# Altium project sensor.PrjPCB
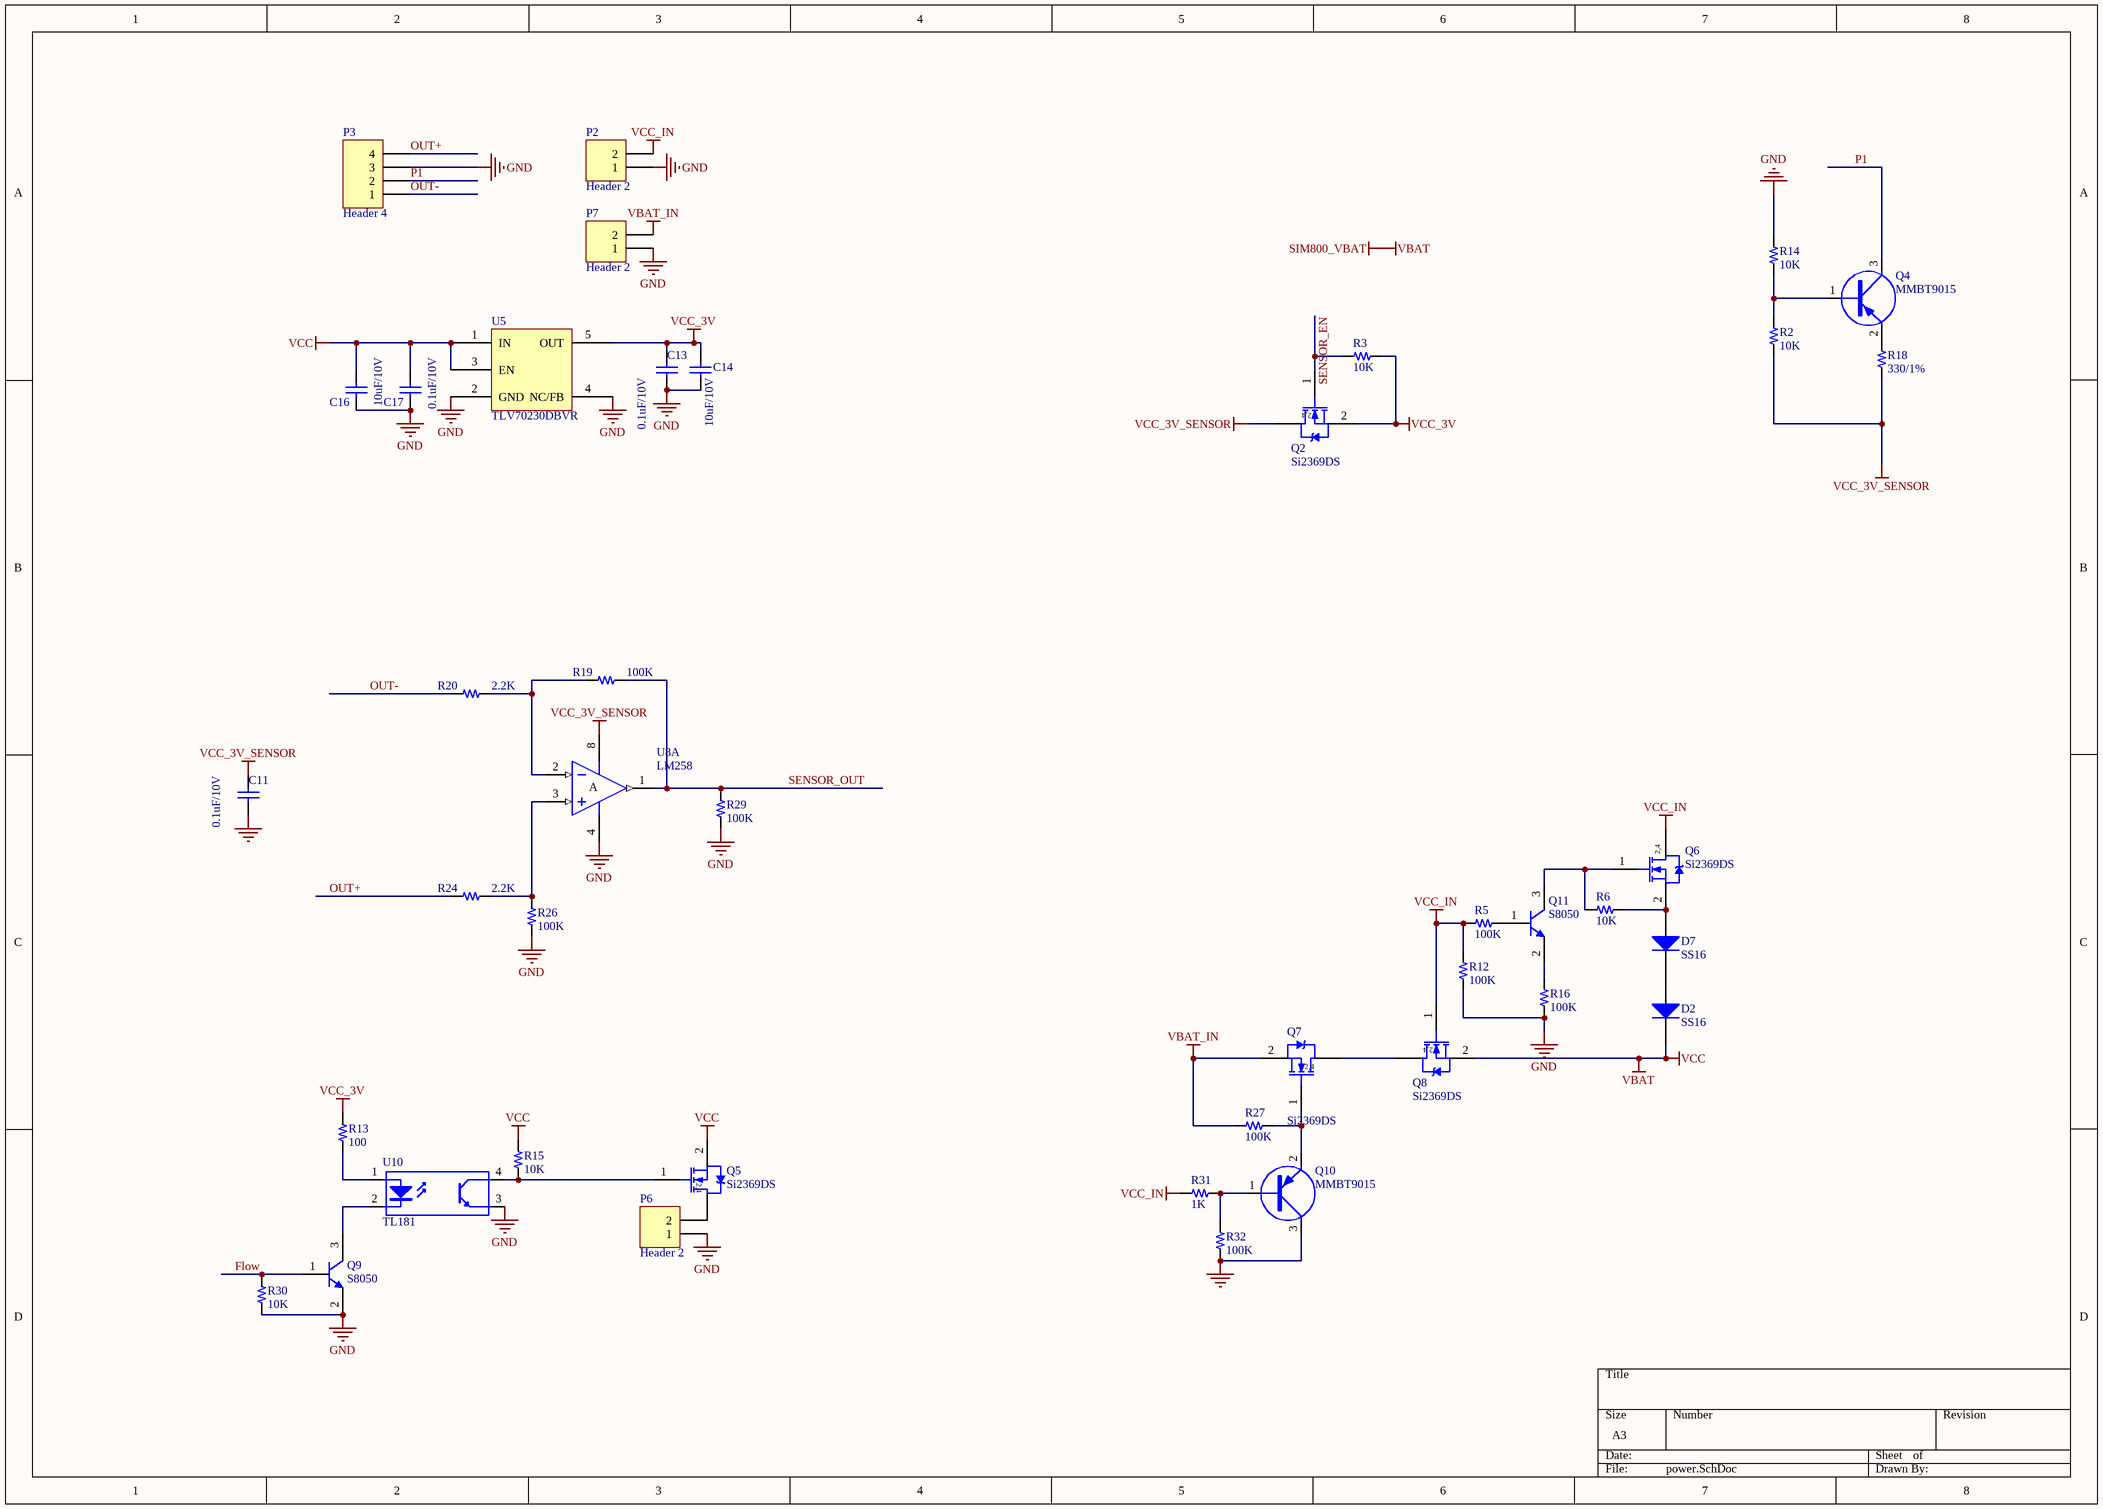
[diagram p0: power.SchDoc]
1 sheet, 42 parts. Net scope: global (net labels, ports and power ports of the same name join across sheets).
Board file: PCB1.PcbDoc

## Sheet power.SchDoc
size A3

### Parts
C11  0.1uF/10V  [0603C]
C13  0.1uF/10V  [0603C]
C14  10uF/10V  [0603C]
C16  10uF/10V  [0603C]
C17  0.1uF/10V  [0603C]
D2  SS16  [SMA]
D7  SS16  [SMA]
P2  Header 2  [2X2.54MM]
P3  Header 4  [HDR1X4]
P6  Header 2  [HDR1X2]
P7  Header 2  [2X2.54MM]
Q2  Si2369DS  [SOT23-3]
Q4  MMBT9015  [SOT23-3]
Q5  Si2369DS  [SOT23-3]
Q6  Si2369DS  [SOT23-3]
Q7  Si2369DS  [SOT23-3]
Q8  Si2369DS  [SOT23-3]
Q9  S8050  [SOT23-3]
Q10  MMBT9015  [SOT23-3]
Q11  S8050  [SOT23-3]
R2  10K  [0603R]
R3  10K  [0603R]
R5  100K  [0603R]
R6  10K  [0603R]
R12  100K  [0603R]
R13  100  [0603R]
R14  10K  [0603R]
R15  10K  [0603R]
R16  100K  [0603R]
R18  330/1%  [0603R]
R19  100K  [0603R]
R20  2.2K  [0603R]
R24  2.2K  [0603R]
R26  100K  [0603R]
R27  100K  [0603R]
R29  100K  [0603R]
R30  10K  [0603R]
R31  1K  [0603R]
R32  100K  [0603R]
U5  TLV70230DBVR  [SOT23-5(DBV)]
U8  LM258  [so-8]  (part A of 2)
U10  TL181  [DIP-4]

### Nets
GND: C11.2 C13.2 C14.1 C16.1 C17.2 P2.1 P3.3 P6.1 P7.1 Q9.2(E) Q10.3(C) R12.2 R14.2 R16.1 R26.1 R29.1 R30.1 R32.1 U5.2(GND) U5.4(NC/FB) U8.4(V-) U10.3(E)
SIM800_VBAT: C16.2 C17.1 D2.2(K) Q5.2(S) Q8.2(S) R15.2 U5.1(IN) U5.3(EN)  [also labelled VBAT, VCC]
VBAT_IN: P7.2 Q7.2(S) R27.1
VCC_3V: C13.1 C14.2 Q2.2(S) R3.1 R13.2 U5.5(OUT)
VCC_3V_SENSOR: C11.1 Q2.3(D) R2.1 R18.1 U8.8(V+)
VCC_IN: P2.2 Q6.3(D) Q8.1(G) R5.1 R12.1 R31.1
Flow: Q9.1(B) R30.2
OUT+: P3.4 R24.1
OUT-: P3.1 R20.1
P1: P3.2 Q4.3(C)
SENSOR_EN: Q2.1(G) R3.2
SENSOR_OUT: R19.2 R29.2 U8.1(OUT)
NetD2_1: D2.1(A) D7.2(K)
NetD7_1: D7.1(A) Q6.2(S) R6.1
NetP6_2: P6.2 Q5.3(D)
NetQ4_1: Q4.1(B) R2.2 R14.1
NetQ4_2: Q4.2(E) R18.2
NetQ5_1: Q5.1(G) R15.1 U10.4(C)
NetQ6_1: Q6.1(G) Q11.3(C) R6.2
NetQ7_1: Q7.1(G) Q10.2(E) R27.2
NetQ7_3: Q7.3(D) Q8.3(D)
NetQ9_3: Q9.3(C) U10.2(K)
NetQ10_1: Q10.1(B) R31.2 R32.2
NetQ11_1: Q11.1(B) R5.2
NetQ11_2: Q11.2(E) R16.2
NetR13_1: R13.1 U10.1(A)
NetR19_1: R19.1 R20.2 U8.2(IN-)
NetR24_2: R24.2 R26.2 U8.3(IN+)

### Notes on the sheet
- (in symbol BUK92150-55A) 2,4
- (in symbol LM258, part A) A

### Library data of the parts
C11 C13 C17 = Cap: Capacitor; Value: 104; Published: 8-Jun-2000; LatestRevisionDate: 17-Jul-2002; LatestRevisionNote: Re-released for DXP Platform.; PackageReference: RAD-0.3; Publisher: Altium Limited
C14 = Cap: Capacitor; Published: 8-Jun-2000; LatestRevisionDate: 17-Jul-2002; LatestRevisionNote: Re-released for DXP Platform.; PackageReference: RAD-0.3; Publisher: Altium Limited; Value: 10uF/10V
C16 = Cap: Capacitor; Value: 106/50V; Published: 8-Jun-2000; LatestRevisionDate: 17-Jul-2002; LatestRevisionNote: Re-released for DXP Platform.; PackageReference: RAD-0.3; Publisher: Altium Limited
D2 D7 = Diode 1N4148: High Conductance Fast Diode; Published: 8-Jun-2000; LatestRevisionDate: 17-Jul-2002; LatestRevisionNote: Re-released for DXP Platform.; DatasheetVersion: 1997; PackageReference: DO-35; Publisher: Altium Limited; Code_JEDEC: DO-204-AH; ComponentLink1Description: Manufacturer Link; ComponentLink1URL: http://www.fairchildsemi.com/; ComponentLink2Description: Datasheet; ComponentLink2URL: http://www.fairchildsemi.com/ds/1N%2F1N4148.pdf
P2 P6 P7 = Header 2: Header, 2-Pin; LatestRevisionDate: 17-Jul-2002; LatestRevisionNote: Re-released for DXP Platform.; Publisher: Altium Limited
P3 = Header 4: Header, 4-Pin; LatestRevisionDate: 17-Jul-2002; LatestRevisionNote: Re-released for DXP Platform.; Publisher: Altium Limited
Q2 Q5-Q8 = BUK92150-55A: Published: 8-Jun-2000; LatestRevisionDate: 17-Jul-2002; LatestRevisionNote: Re-released for DXP Platform.; DatasheetVersion: 6-Oct-1997; PackageVersion: Aug-1998; PackageReference: TSOP-6; Publisher: Altium Limited; PackageDescription: SOT-457/SC-74; 6 Leads; Body 3.1 x 3 mm, inc. leads (LxW max); ComponentLink1Description: Manufacturer Link; ComponentLink1URL: http://www.vishay.com/; ComponentLink2Description: Datasheet; ComponentLink2URL: http://www.vishay.com/docs/70192/70192.pdf
Q4 Q10 = PNP
Q9 Q11 = NPN
R2 R3 R5 R6 R12-R16 R18-R20 R24 R26 R27 R29-R32 = R
U10 = Optoisolator1: 4-Pin Phototransistor Optocoupler; Published: 24-Mar-1999; LatestRevisionDate: 04-Mar-2005; LatestRevisionNote: Sch pins 3 & 4 Swapped.; DatasheetVersion: Nov-2003; PackageReference: DIP-4; Publisher: Altium Limited